# Altium schematic sheet Basic_flex_IMU.SchDoc
size A4; DrawnBy: Philip Rowse
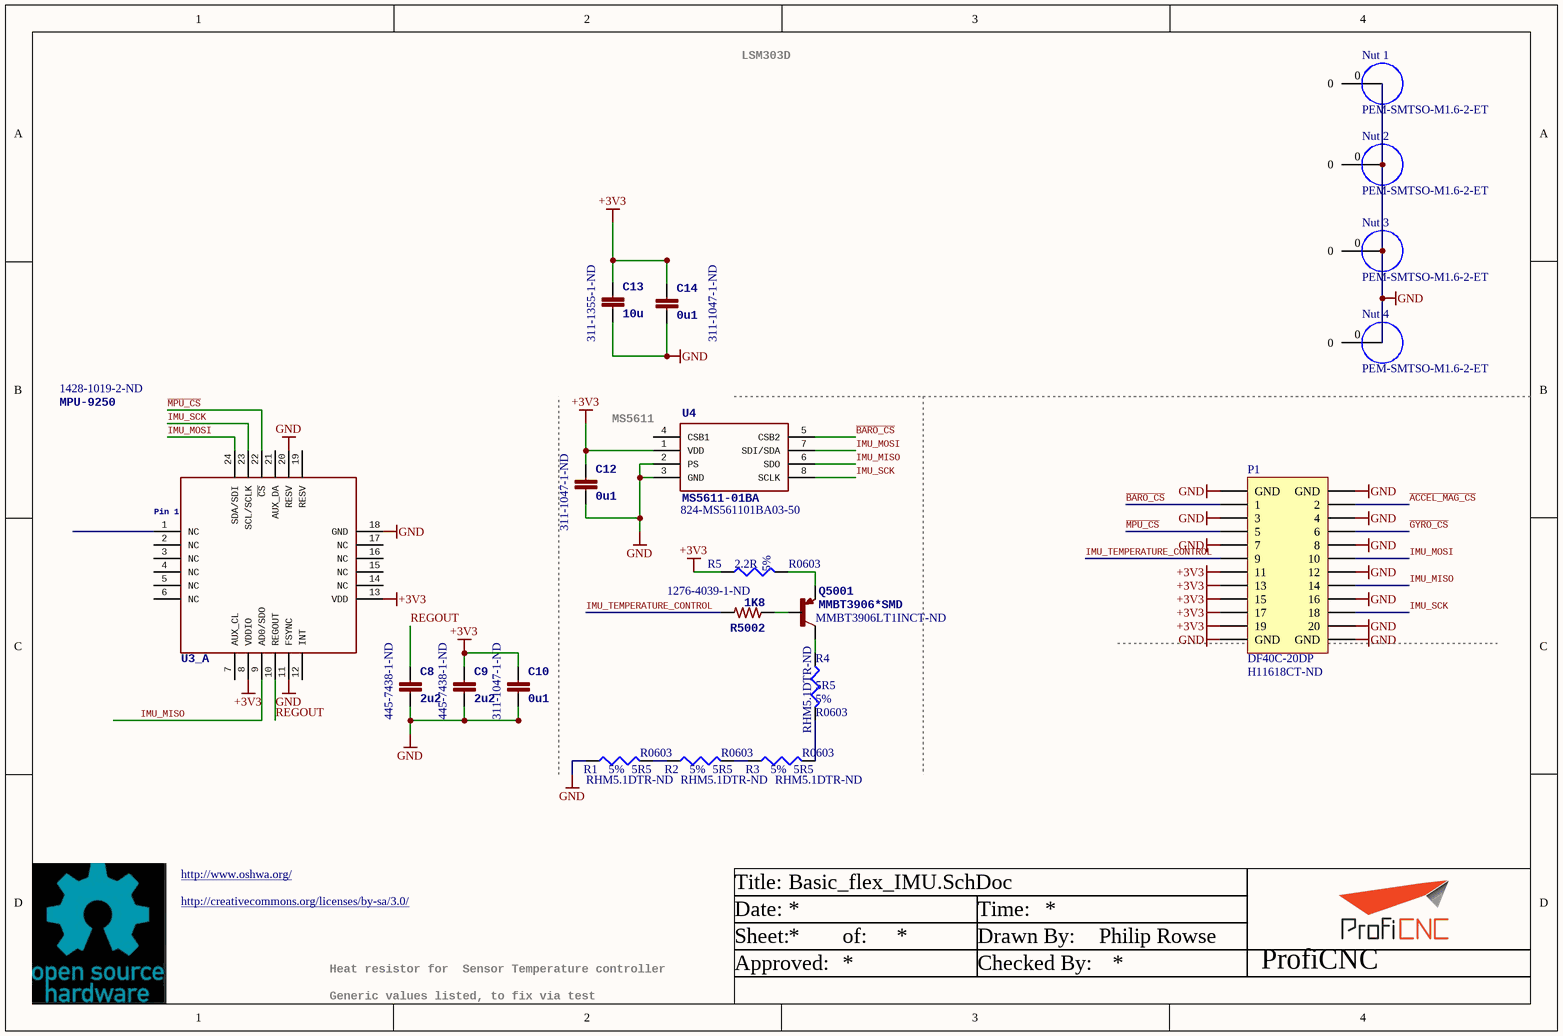
[diagram p0: Basic_flex_IMU.SchDoc]

## Parts
C8  2u2  Supplier Part Number 1: 445-7438-1-ND  [0603-CAP]
C9  2u2  Supplier Part Number 1: 445-7438-1-ND  [0603-CAP]
C10  0u1  Supplier Part Number 1: 311-1047-1-ND  [0402-CAP]
C12  0u1  Supplier Part Number 1: 311-1047-1-ND  [0402-CAP]
C13  10u  Supplier Part Number 1: 311-1355-1-ND  [0805-CAP]
C14  0u1  Supplier Part Number 1: 311-1047-1-ND  [0402-CAP]
Nut_1  PEM-SMTSO-M1.6-2-ET  [PEM-SMTSO-M1.6-2-ET]
Nut_2  PEM-SMTSO-M1.6-2-ET  [PEM-SMTSO-M1.6-2-ET]
Nut_3  PEM-SMTSO-M1.6-2-ET  [PEM-SMTSO-M1.6-2-ET]
Nut_4  PEM-SMTSO-M1.6-2-ET  [PEM-SMTSO-M1.6-2-ET]
P1  DF40C-20DP  Supplier Part Number 1: H11618CT-ND  [DF40C-20-DP]
Q5001  MMBT3906*SMD  Supplier Part Number 1: MMBT3906LT1INCT-ND  [SOT23-BEC]
R1  value 5R5  Tolerance: 5%  Supplier Part Number 1: RHM5.1DTR-ND  [R0603]  (hidden comment: Resistor)
R2  value 5R5  Tolerance: 5%  Supplier Part Number 1: RHM5.1DTR-ND  [R0603]  (hidden comment: Resistor)
R3  value 5R5  Tolerance: 5%  Supplier Part Number 1: RHM5.1DTR-ND  [R0603]  (hidden comment: Resistor)
R4  value 5R5  Tolerance: 5%  Supplier Part Number 1: RHM5.1DTR-ND  [R0603]  (hidden comment: Resistor)
R5  value 2.2R  Tolerance: 5%  [R0603]  (hidden comment: Resistor)
R5002  1K8  Supplier Part Number 1: 1276-4039-1-ND  [0402-RES]
U3_A  MPU-9250  Supplier Part Number 1: 1428-1019-2-ND  [MPU-9250]
U4  MS5611-01BA  Supplier Part Number 1: 824-MS561101BA03-50  [MS5611-01BA]

## Nets
+3V3: C9.P$1 C10.P$1 C12.P$1 C13.P$1 C14.P$1 P1.11 P1.13 P1.15 P1.17 P1.19 R5.1 U3_A.8(VDDIO) U3_A.13(VDD) U4.1(VDD)
GND: C8.P$2 C9.P$2 C10.P$2 C12.P$2 C13.P$2 C14.P$2 Nut_1.0 Nut_2.0 Nut_3.0 Nut_4.0 P1.3 P1.4 P1.7 P1.8 P1.12 P1.16 P1.20 P1.21(GND) P1.22(GND) P1.23(GND) P1.24(GND) R1.1 U3_A.11(FSYNC) U3_A.18(GND) U3_A.20(RESV) U4.2(PS) U4.3(GND)
~{ACCEL_MAG_CS}: P1.2
~{BARO_CS}: P1.1 U4.5(CSB2)
~{GYRO_CS}: P1.6
IMU_MISO: P1.14 U3_A.9(AD0/SDO) U4.6(SDO)
IMU_MOSI: P1.10 U3_A.24(SDA/SDI) U4.7(SDI/SDA)
IMU_SCK: P1.18 U3_A.23(SCL/SCLK) U4.8(SCLK)
IMU_TEMPERATURE_CONTROL: P1.9 R5002.P$2
~{MPU_CS}: P1.5 U3_A.22(~{CS})
REGOUT: C8.P$1 U3_A.10(REGOUT)
NetQ5001_B: Q5001.B R5002.P$1
NetQ5001_C: Q5001.C R4.1
NetQ5001_E: Q5001.E R5.2
NetR1_2: R1.2 R2.1
NetR2_2: R2.2 R3.1
NetR3_2: R3.2 R4.2

Not connected (* = marked no-connect by the designer): U3_A 1(NC) 2(NC) 3(NC) 4(NC) 5(NC) 6(NC) 7(AUX_CL) 12(INT) 14(NC) 15(NC) 16(NC) 17(NC) 19(RESV) 21(AUX_DA); U4 4(CSB1)

## Notes on the sheet
- LSM303D
- (near U4) MS5611
- Heat resistor for
  Sensor Temperature controller
- Generic values listed, to fix via test
- http://www.oshwa.org/
- http://creativecommons.org/licenses/by-sa/3.0/
- Title:
- Date:
- Time:
- Sheet:
- Approved:
- of:
- Drawn By:
- Checked By:
- ProfiCNC

## Library data of the parts
C8 C9 = CAPACITOR-0603: Capacitor, 2.2uF, 16V, 10%, X6S, 0603, Ceramic; PARTNO: C1608X6S1C225K080AC; 3DR_PARTNO: ECM0619; Supplier 1: Digi-Key; Value: 2u2
C10 C12 C14 = CAPACITOR-0402: Capacitor, 0.1uF, 16V, Y5V, 0402, Ceramic; PARTNO: CC0402ZRY5V7BB104; 3DR_PARTNO: ECM0700; Supplier 1: Digi-Key; Value: 0u1
C13 = CAPACITOR-0805: Capacitor, 10uF, 10V, Y5V, 0805, Ceramic; PARTNO: CC0805ZKY5V6BB106; 3DR_PARTNO: ECM0713; Supplier 1: Digi-Key; Value: 10u
Nut_1-Nut_4 = PEM-SMTSO-M1.6-2-ET: Fastener, M1.6x2mm, SMTSO, Carbon Steel; Mfg Part Num (Alternate): Check; Manufacturer 1: PennEngineering; 3DR_PARTNO: PRT0438; Manufacturer Part Number 1: PEM-SMTSO-M1.6-2-ET; Supplier Unit Price 1: 0.7; Supplier Part Number 1: PEM-SMTSO-M1.6-2-ET; Supplier 1: PennEngineering
P1 = DF40C-20DP: Connector, HDR, 20Pos, 0.4mm, SMD, GOLD; 3DR_PARTNO: ECM0510; Value: DF40C-20DP-0.4V(51); LatestRevisionDate: 17-Jul-2002; LatestRevisionNote: Re-released for DXP Platform.; Publisher: Altium Limited; Supplier 1: Digi-Key
Q5001 = MMBT3906*SMD: TRANSISTOR SWITCHING PNP SOT-23; 3DR_PARTNO: ECM0833; PARTNO: MMBT 3906 LT1; Supplier 1: Digi-Key
R1-R5 = Resistor: RES SMD 5.1 OHM 5% 1/4W 0603
  R1-R4: Supplier 1: Digi-Key
R5002 = RESISTOR0402-RES: RES 1.8K OHM 1/16W 1% 0402; PARTNO: RC1005F182CS; 3DR_PARTNO: ECM0807; Supplier 1: Digi-Key; Value: 1K8
U3_A = MPU-6500: PARTNO: MPU-9250; Pin 1: Pin 1; Supplier 1: Digi-Key
U4 = MS5611-01BA: Board, Digital pressure sensor I2C/SPI; 3DR_PARTNO: ECM0835; DATASHEET: http://www.meas-spec.com/downloads/MS5611-01BA01.pdf; LINK: http://www.meas-spec.com/product/t_product.aspx?id=8503#; MFGPN: MS5611-01BA; PARTNO: MS5611-01BA; Supplier 1: Mouser